# EAGLE schematic Papra v0.20 (EAGLE 9.6.2)
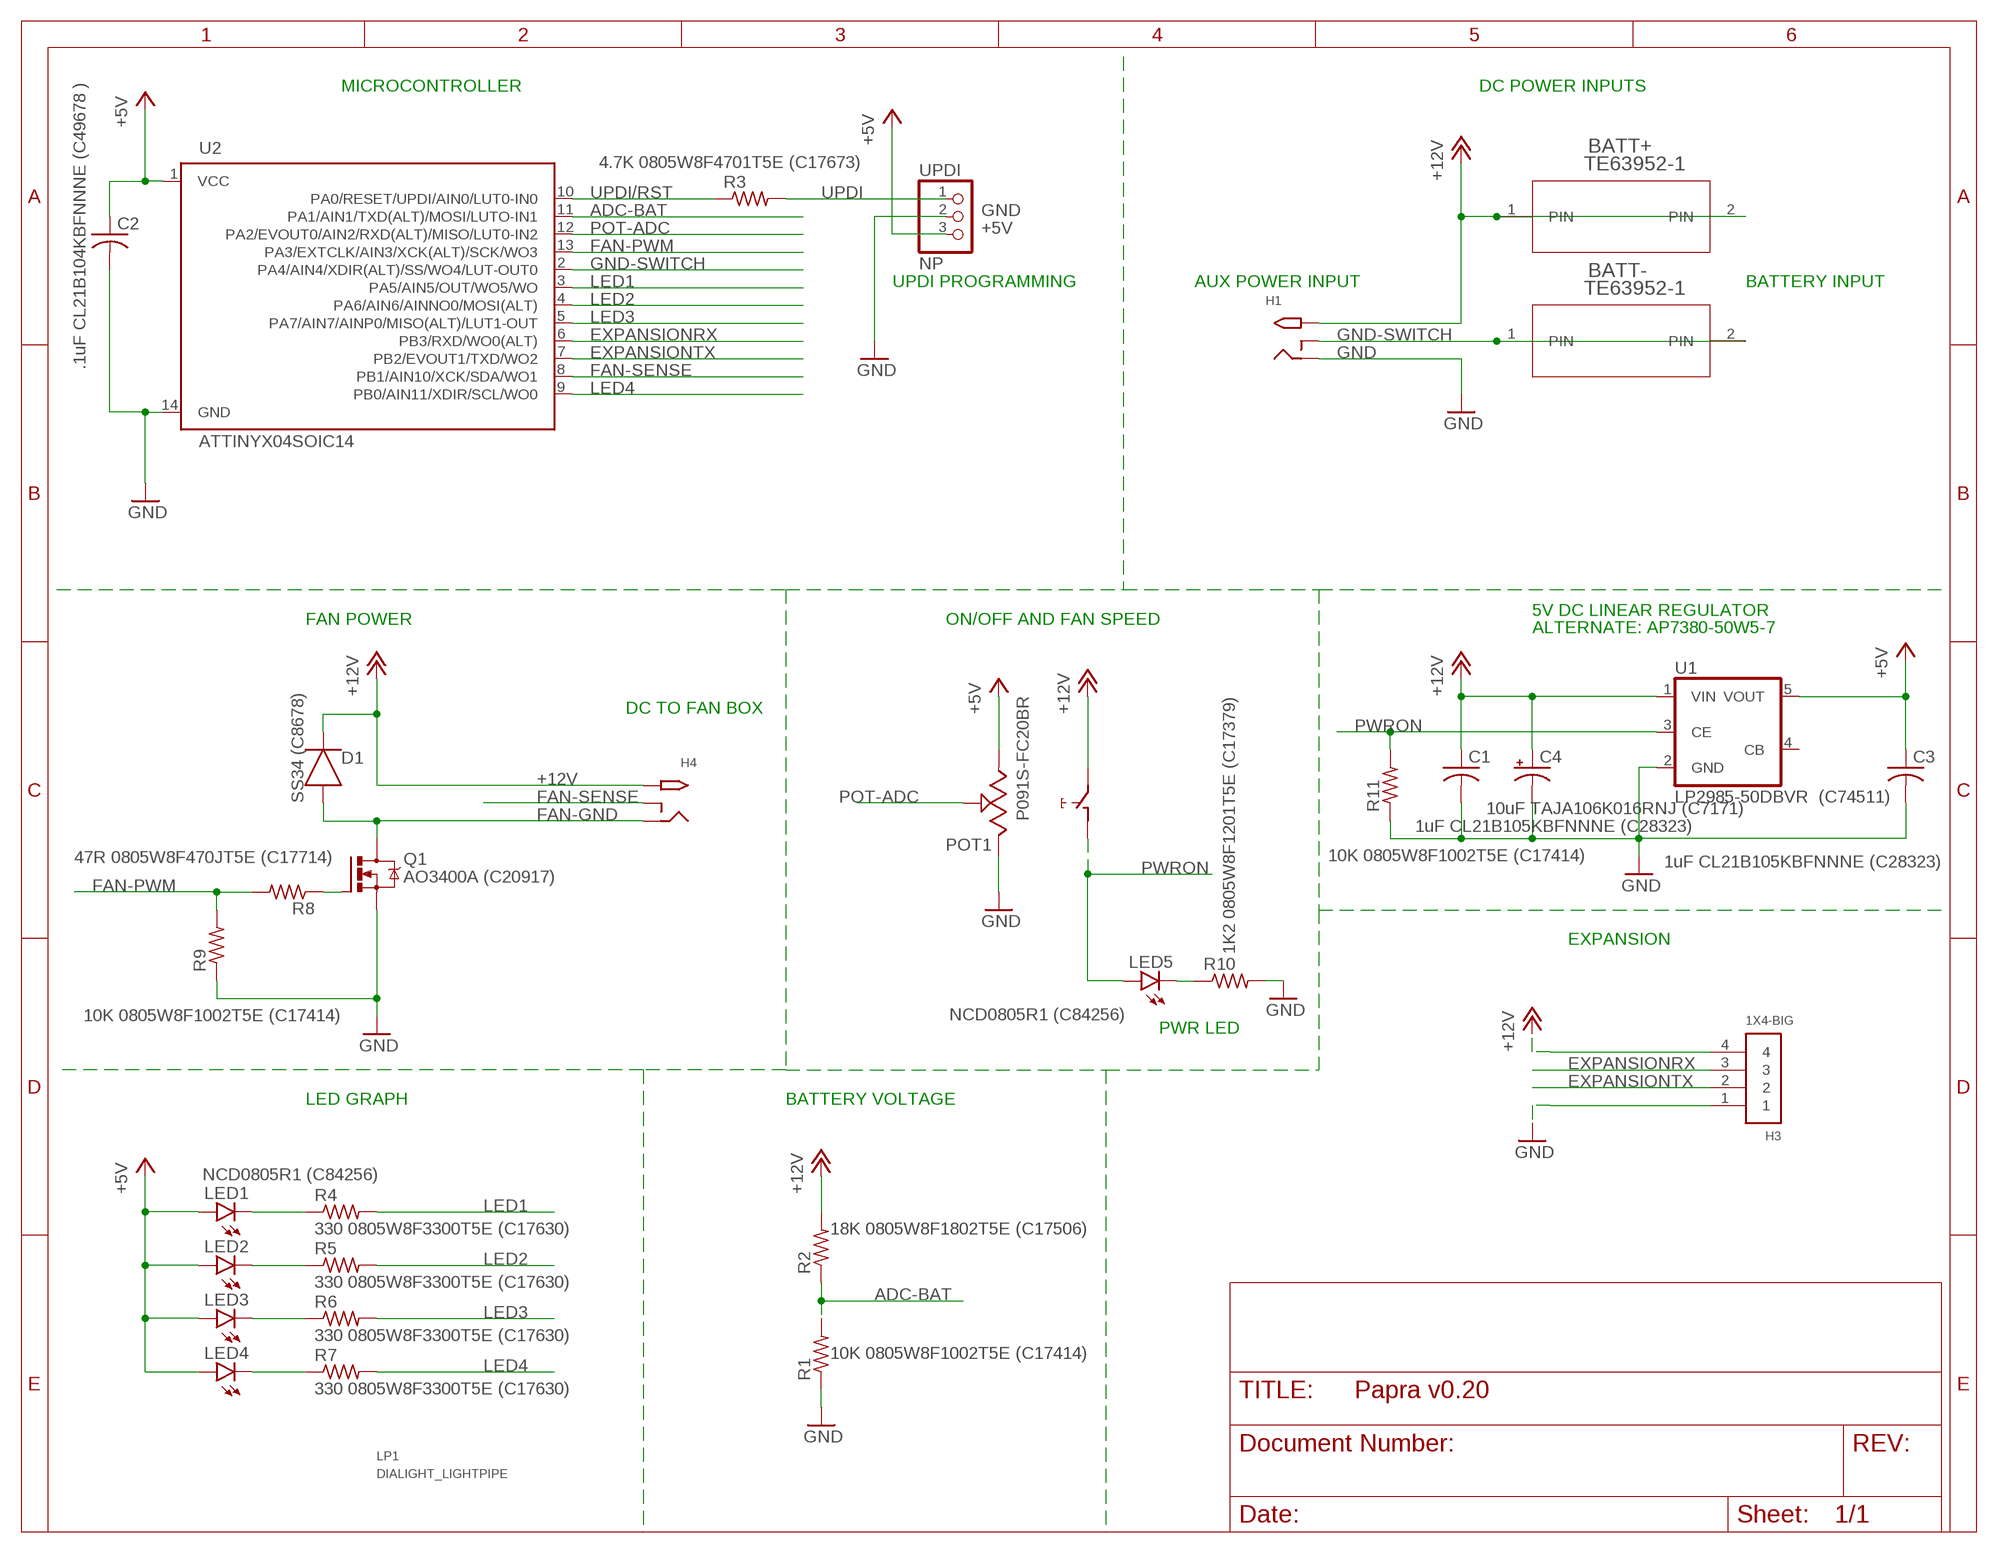
[diagram p0: schematic, sheet 1]

## Parts
BATT+  TE63952-1  [TE63952-1]
BATT-  TE63952-1  [TE63952-1]
C1  1uF CL21B105KBFNNNE (C28323)  C-USC0805  [C0805]
C2  .1uF CL21B104KBFNNNE (C49678 )  C-USC0805  [C0805]
C3  1uF CL21B105KBFNNNE (C28323)  C-USC0805  [C0805]
C4  10uF TAJA106K016RNJ (C7171)  CPOL-USA/3216-18R  [A/3216-18R]
D1  SS34 (C8678)  DIODEDO-214AC(SMA)  [DIOM5226X290N]
H1  M-CUI-PJ-066A  PJ-066A  [DCJACK-PJ-066A]
H3  1X4-BIG  [1X04-BIG]
H4  M-CUI-PJ-066A  PJ-066A  [DCJACK-PJ-066A]
LED1  NCD0805R1 (C84256)  LEDCHIPLED_0805  [CHIPLED_0805]
LED2  NCD0805R1 (C84256)  LEDCHIPLED_0805  [CHIPLED_0805]
LED3  NCD0805R1 (C84256)  LEDCHIPLED_0805  [CHIPLED_0805]
LED4  NCD0805R1 (C84256)  LEDCHIPLED_0805  [CHIPLED_0805]
LED5  NCD0805R1 (C84256)  LEDCHIPLED_0805  [CHIPLED_0805]
LP1  DIALIGHT_LIGHTPIPE  [DIALIGHT_5151020F_/LEDS]
POT1  P091S-FC20BR  [P091S-FC20BR]
Q1  AO3400A (C20917)  NMOSFET_BSS123-SOT23  [SOT23]
R1  10K 0805W8F1002T5E (C17414)  R-US_R0805  [R0805]
R2  18K 0805W8F1802T5E (C17506)  R-US_R0805  [R0805]
R3  4.7K 0805W8F4701T5E (C17673)  R-US_R0805  [R0805]
R4  330 0805W8F3300T5E (C17630)  R-US_R0805  [R0805]
R5  330 0805W8F3300T5E (C17630)  R-US_R0805  [R0805]
R6  330 0805W8F3300T5E (C17630)  R-US_R0805  [R0805]
R7  330 0805W8F3300T5E (C17630)  R-US_R0805  [R0805]
R8  47R 0805W8F470JT5E (C17714)  R-US_R0805  [R0805]
R9  10K 0805W8F1002T5E (C17414)  R-US_R0805  [R0805]
R10  1K2 0805W8F1201T5E (C17379)  R-US_R0805  [R0805]
R11  10K 0805W8F1002T5E (C17414)  R-US_R0805  [R0805]
U1  LP2985-50DBVR (C74511)  TS520533  [SOT25]
U2  ATTINYX04SOIC14  [SOIC127P600X144-14]
UPDI  NP  PINHD-1X3  [1X03]

## Nets
+5V [RAIL]: C2.1 C3.1 LED1.A LED2.A LED3.A LED4.A POT1.1 U1.5(VOUT) U2.1(VCC) UPDI.3
+12V [RAIL]: BATT+.1(PIN) BATT+.2(PIN) C1.1 C4.+ D1.1(C) H1.PWR(TIP) H3.4 H4.PWR(TIP) POT1.NO R2.2 U1.1(VIN)
ADC-BAT: R1.2 R2.1 U2.11(PA1/AIN1/TXD(ALT)/MOSI/LUTO-IN1)
EXPANSIONRX: H3.3 U2.6(PB3/RXD/WO0(ALT))
EXPANSIONTX: H3.2 U2.7(PB2/EVOUT1/TXD/WO2)
FAN-GND [RAIL]: D1.2(A) H4.GND(RING) Q1.3(D)
FAN-PWM: R8.2 R9.2 U2.13(PA3/EXTCLK/AIN3/XCK(ALT)/SCK/WO3)
FAN-SENSE: H4.GNDBREAK(RING_SW) U2.8(PB1/AIN10/XCK/SDA/WO1)
FETGATE: Q1.1(G) R8.1
GND: C1.2 C2.2 C3.2 C4.- H1.GND(RING) H3.1 POT1.3 Q1.2(S) R1.1 R9.1 R10.2 R11.1 U1.2(GND) U2.14(GND) UPDI.2
GND-SWITCH: BATT-.1(PIN) BATT-.2(PIN) H1.GNDBREAK(RING_SW) U2.2(PA4/AIN4/XDIR(ALT)/SS/WO4/LUT-OUT0)
LED1: R4.2 U2.3(PA5/AIN5/OUT/WO5/WO)
LED1-R: LED1.C R4.1
LED2: R5.2 U2.4(PA6/AIN6/AINNO0/MOSI(ALT))
LED2-R: LED2.C R5.1
LED3: R6.2 U2.5(PA7/AIN7/AINP0/MISO(ALT)/LUT1-OUT)
LED3-R: LED3.C R6.1
LED4: R7.2 U2.9(PB0/AIN11/XDIR/SCL/WO0)
LED4-R: LED4.C R7.1
LED5-R: LED5.C R10.1
POT-ADC: POT1.2 U2.12(PA2/EVOUT0/AIN2/RXD(ALT)/MISO/LUT0-IN2)
PWRON: LED5.A POT1.COM R11.2 U1.3(CE)
UPDI: R3.2 UPDI.1
UPDI/RST: R3.1 U2.10(PA0/RESET/UPDI/AIN0/LUT0-IN0)
Unconnected: U1.4(CB)

## Notes on the sheet
- MICROCONTROLLER | DC POWER INPUTS
- UPDI PROGRAMMING | AUX POWER INPUT | BATTERY INPUT
- 5V DC LINEAR REGULATOR
- FAN POWER | ON/OFF AND FAN SPEED
- ALTERNATE: AP7380-50W5-7
- DC TO FAN BOX
- EXPANSION
- PWR LED
- LED GRAPH | BATTERY VOLTAGE

## Library data of the parts
BATT+ BATT- = PC-LIB:TE63952-1
C1-C3 = rcl:C-US: CAPACITOR, American symbol; SPICEPREFIX: C
C4 = rcl:CPOL-US: POLARIZED CAPACITOR, American symbol; SPICEPREFIX: C
D1 = Diode:DIODE: Diode Rectifier - Generic; CATEGORY: Diode; SUB-CATEGORY: Rectifier; VALUE: DIODE
H1 H4 = PC-LIB:PJ-066A
H3 = adafruit:1X4: 4-pin connector
LED1-LED5 = led:LED: LED OSRAM: - CHIPLED LG R971, LG N971, LY N971, LG Q971, LY Q971, LO R971, LY R971 LH N974, LH R974 LS Q976, LO Q976, LY Q976 LO Q996 - Hyper CHIPLED LW Q18S LB Q993, LB Q99A, LB R99A - SideLED LS A670, LO A670, LY A670, LG A670, LP A670 LB A673, LV A673, LT A673, LW A673 LH A674 LY A675 LS A676, LA A676, LO A676, LY A676, LW A676 LS A679, LY A679, LG A679 - Hyper Micro SIDELED® LS Y876, LA Y876, LO Y876, LY Y876 LT Y87S - SmartLED LW L88C, LW L88S LB L89C, LB L89S, LG L890 LS L89K, LO L89K, LY L89K LS L896, LA L896, LO L896, LY L896 - TOPLED LS T670, LO T670, LY T670, LG T670, LP T670 LSG T670, LSP T670, LSY T670, LOP T670, LYG T670 LG T671, LOG T671, LSG T671 LB T673, LV T673, LT T673, LW T673 LH T674 LS T676, LA T676, LO T676, LY T676, LB T676, LH T676, LSB T676, LW T676 LB T67C, LV T67C, LT T67C, LS T67K, LO T67K, LY T67K, LW E67C LS E67B, LA E67B, LO E67B, LY E67B, LB E67C, LV E67C, LT E67C LW T67C LS T679, LY T679, LG T679 LS T770, LO T770, LY T770, LG T770, LP T770 LB T773, LV T773, LT T773, LW T773 LH T774 LS E675, LA E675, LY E675, LS T675 LS T776, LA T776, LO T776, LY T776, LB T776 LHGB T686 LT T68C, LB T68C - Hyper Mini TOPLED® LB M676 - Mini TOPLED Santana® LG M470 LS M47K, LO M47K, LY M47K Source: http://www.osram.convergy.de LUXEON: - LUMILED® LXK2-PW12-R00, LXK2-PW12-S00, LXK2-PW14-U00, LXK2-PW14-V00 LXK2-PM12-R00, LXK2-PM12-S00, LXK2-PM14-U00 LXK2-PE12-Q00, LXK2-PE12-R00, LXK2-PE12-S00, LXK2-PE14-T00, LXK2-PE14-U00 LXK2-PB12-K00, LXK2-PB12-L00, LXK2-PB12-M00, LXK2-PB14-N00, LXK2-PB14-P00, LXK2-PB14-Q00 LXK2-PR12-L00, LXK2-PR12-M00, LXK2-PR14-Q00, LXK2-PR14-R00 LXK2-PD12-Q00, LXK2-PD12-R00, LXK2-PD12-S00 LXK2-PH12-R00, LXK2-PH12-S00 LXK2-PL12-P00, LXK2-PL12-Q00, LXK2-PL12-R00 Source: www.luxeon.com KINGBRIGHT: KA-3528ASYC Source: www.kingbright.com
LP1 = PC-LIB:DIALIGHT_LIGHTPIPE: DIALIGHT QUAD LIGHTPIPE 515-1020 WITH 0805LEDS
POT1 = PC-LIB:P091S-FC20BR: TT P091S-FC20BR10K
Q1 = Transistor:NMOSFET_: N-Channel MOSFET - Popular parts; CATEGORY: Transistor; DESCRIPTION: MOSFET N-CH 100V 0.17A SOT-23; DRAIN_CURRENT: 170mA; MANUFACTURER: ON Semiconductor; MPN: BSS123L; OPERATING_TEMP: -55°C ~ 150°C; PART_STATUS: Active; ROHS_COMPLIANT: Yes; SUB-CATEGORY: MOSFET; THERMALLOSS: 360mW; TYPE: N-Channel; VALUE: BSS123
R1-R11 = rcl:R-US_: RESISTOR, American symbol; SPICEPREFIX: R
U1 = v-reg:TS5205: 150mA Low Noise LDO Voltage Regulator with Enable TSC [Taiwan Semiconductor Company, Ltd] Source: http://www.taiwansemi.com .. 5205_0409c.pdf
U2 = PC-LIB:ATTINYX04
UPDI = adafruit:PINHD-1X3: PIN HEADER

## Net classes
0 default: width 0.254 mm, clearance 0.203 mm
1 RAIL: width 0.508 mm, clearance 0.254 mm